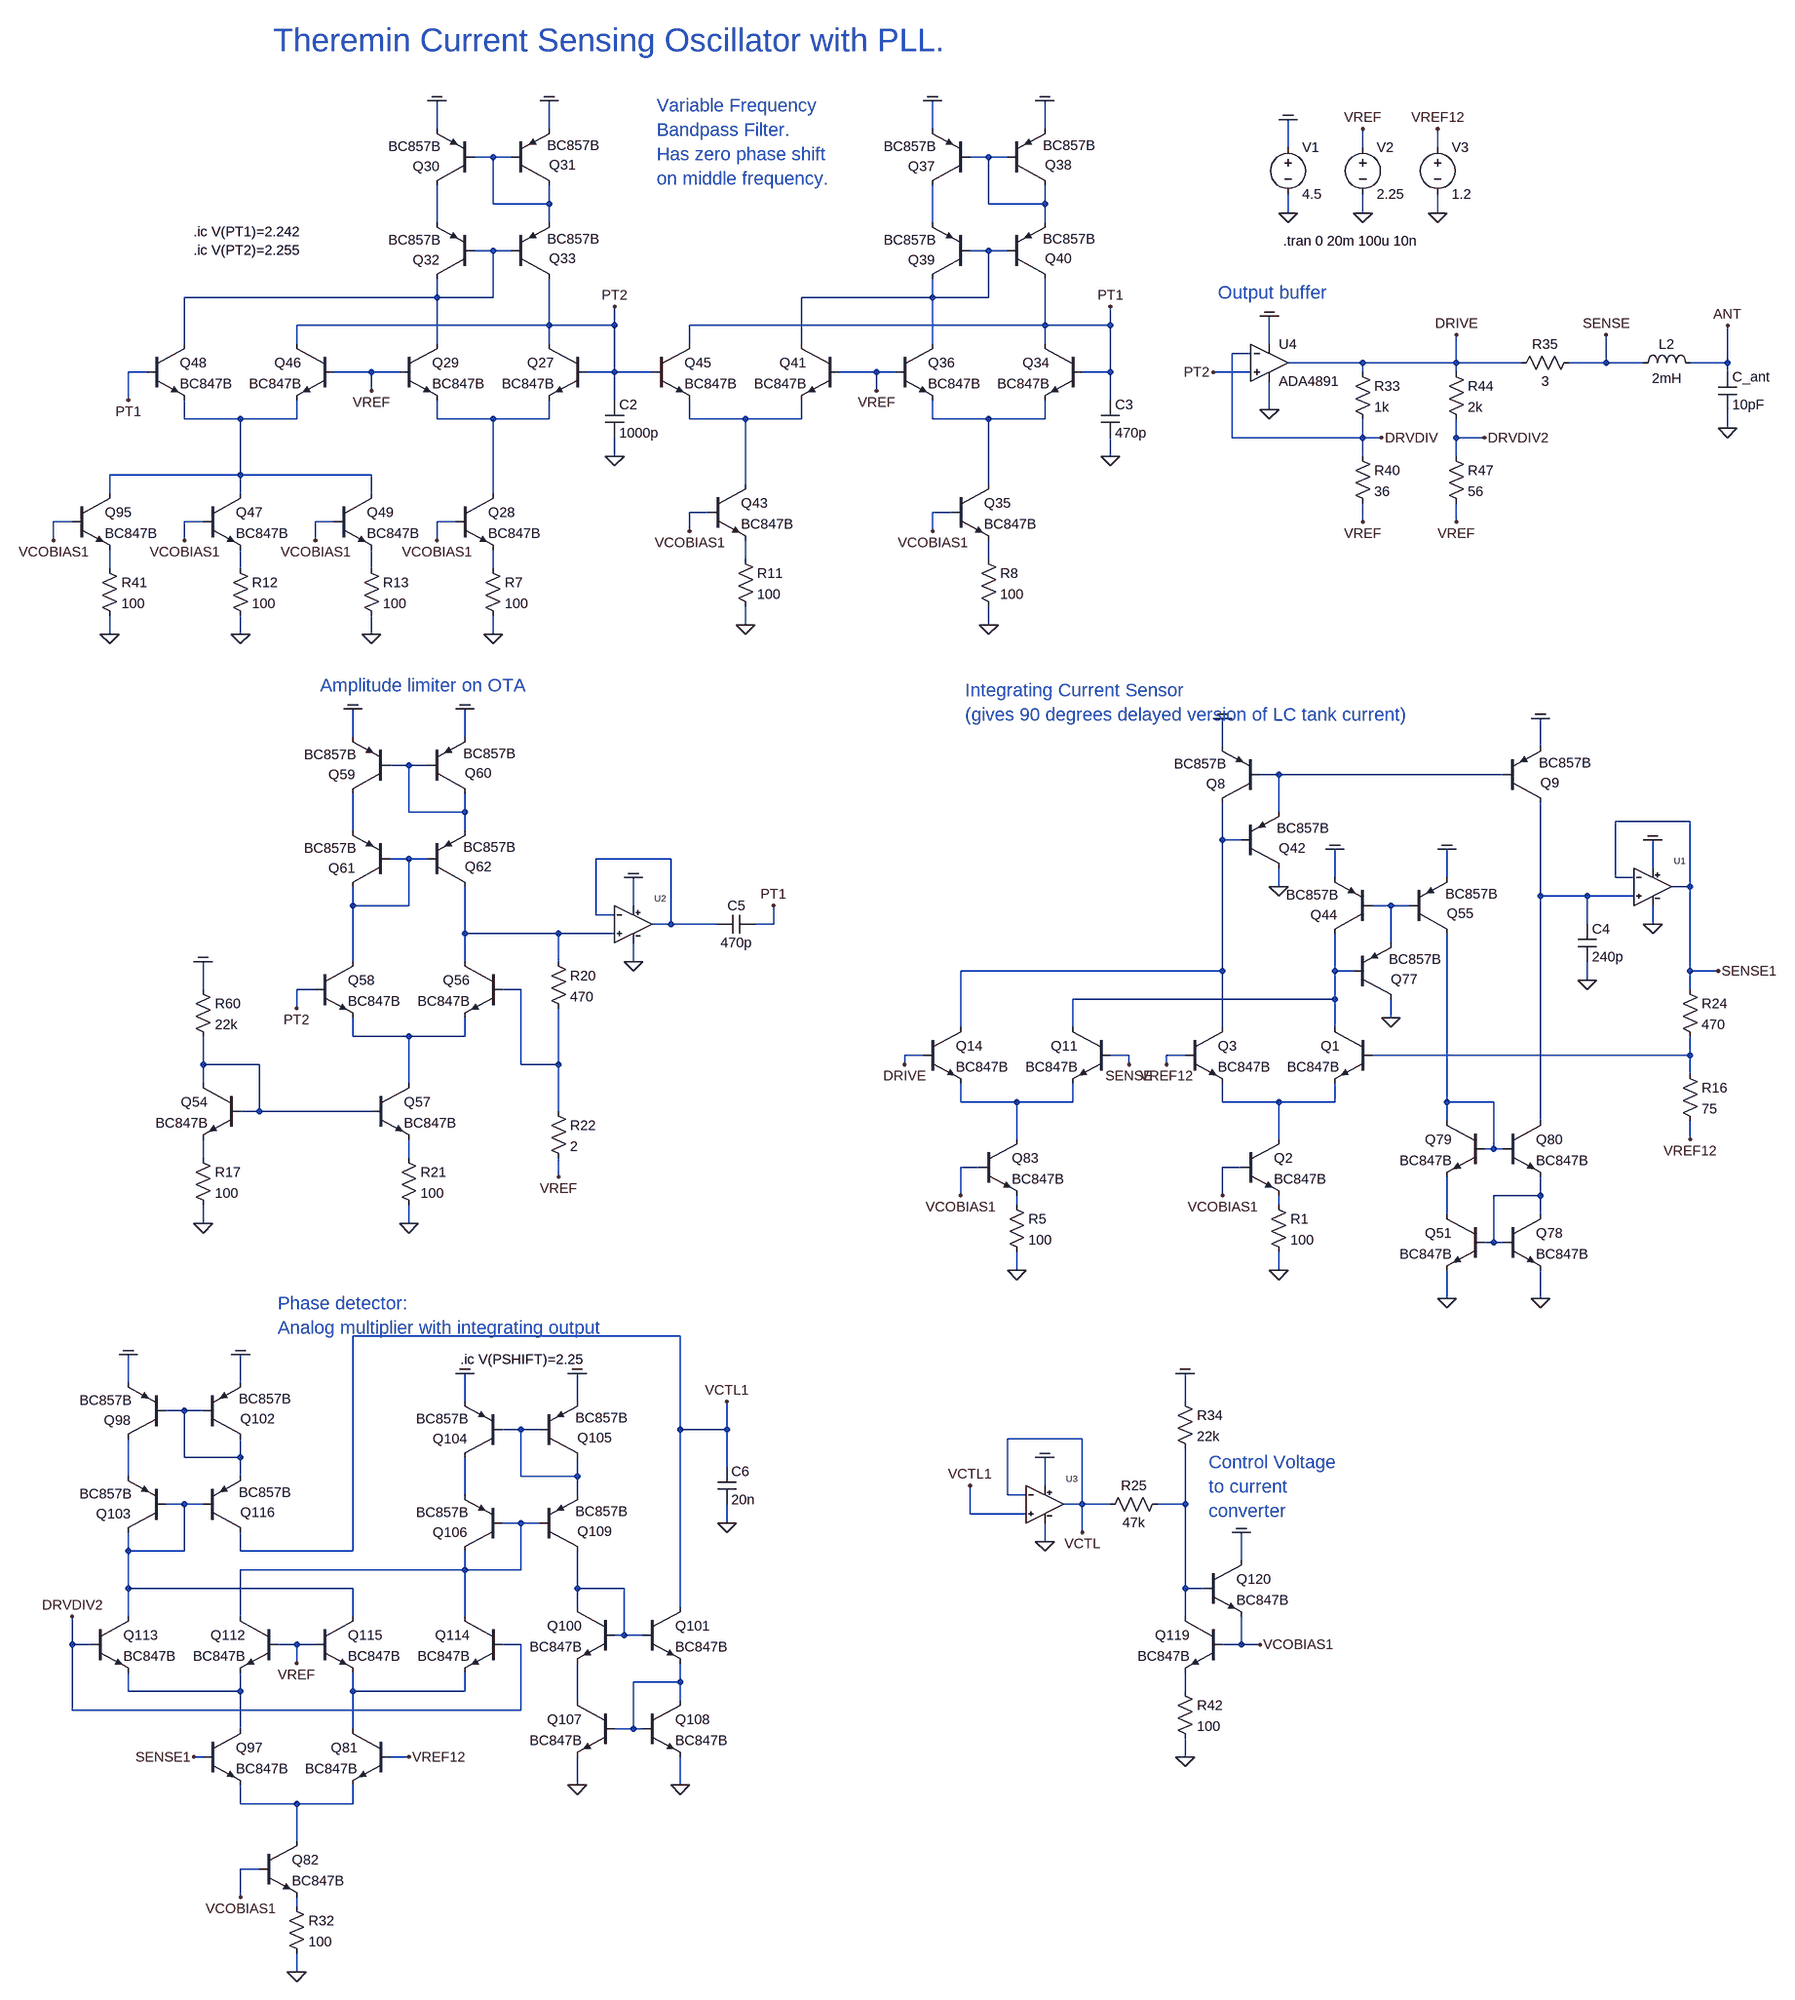
[diagram p0: schematic vco_and_lc_drive_v05.asc]
vco_and_lc_drive_v05.asc, the LTspice schematic file:
Version 4
SHEET 1 13504 21184
WIRE -5552 15856 -5552 15808
WIRE -5360 15856 -5360 15808
WIRE -4704 15856 -4704 15808
WIRE -4512 15856 -4512 15808
WIRE -4096 15888 -4096 15840
WIRE -3968 15888 -3968 15856
WIRE -3840 15888 -3840 15856
WIRE -5456 15904 -5488 15904
WIRE -5424 15904 -5456 15904
WIRE -4608 15904 -4640 15904
WIRE -4576 15904 -4608 15904
WIRE -5456 15984 -5456 15904
WIRE -5360 15984 -5360 15952
WIRE -5360 15984 -5456 15984
WIRE -4608 15984 -4608 15904
WIRE -4512 15984 -4512 15952
WIRE -4512 15984 -4608 15984
WIRE -4096 16000 -4096 15968
WIRE -3968 16000 -3968 15968
WIRE -3840 16000 -3840 15968
WIRE -5552 16016 -5552 15952
WIRE -5360 16016 -5360 15984
WIRE -4704 16016 -4704 15952
WIRE -4512 16016 -4512 15984
WIRE -5456 16064 -5488 16064
WIRE -5424 16064 -5456 16064
WIRE -4608 16064 -4640 16064
WIRE -4576 16064 -4608 16064
WIRE -5552 16144 -5552 16112
WIRE -5552 16144 -5984 16144
WIRE -5456 16144 -5456 16064
WIRE -5456 16144 -5552 16144
WIRE -4704 16144 -4704 16112
WIRE -4704 16144 -4928 16144
WIRE -4608 16144 -4608 16064
WIRE -4608 16144 -4704 16144
WIRE -5360 16192 -5360 16112
WIRE -5360 16192 -5792 16192
WIRE -5248 16192 -5248 16160
WIRE -5248 16192 -5360 16192
WIRE -4512 16192 -4512 16112
WIRE -4512 16192 -5120 16192
WIRE -4400 16192 -4400 16160
WIRE -4400 16192 -4512 16192
WIRE -5984 16224 -5984 16144
WIRE -5792 16224 -5792 16192
WIRE -5552 16224 -5552 16144
WIRE -5360 16224 -5360 16192
WIRE -5120 16224 -5120 16192
WIRE -4928 16224 -4928 16144
WIRE -4704 16224 -4704 16144
WIRE -4512 16224 -4512 16192
WIRE -4128 16224 -4128 16176
WIRE -4160 16240 -4192 16240
WIRE -3968 16256 -4096 16256
WIRE -3808 16256 -3808 16208
WIRE -3808 16256 -3968 16256
WIRE -3696 16256 -3808 16256
WIRE -3552 16256 -3552 16208
WIRE -3552 16256 -3616 16256
WIRE -3488 16256 -3552 16256
WIRE -3344 16256 -3344 16192
WIRE -3344 16256 -3408 16256
WIRE -6048 16272 -6080 16272
WIRE -5664 16272 -5728 16272
WIRE -5616 16272 -5664 16272
WIRE -5248 16272 -5248 16192
WIRE -5248 16272 -5296 16272
WIRE -5184 16272 -5248 16272
WIRE -4800 16272 -4864 16272
WIRE -4768 16272 -4800 16272
WIRE -4400 16272 -4400 16192
WIRE -4400 16272 -4448 16272
WIRE -4160 16272 -4224 16272
WIRE -3968 16272 -3968 16256
WIRE -3808 16272 -3808 16256
WIRE -3344 16272 -3344 16256
WIRE -5664 16304 -5664 16272
WIRE -4800 16304 -4800 16272
WIRE -6080 16320 -6080 16272
WIRE -5248 16320 -5248 16272
WIRE -4400 16320 -4400 16272
WIRE -4128 16336 -4128 16288
WIRE -5984 16352 -5984 16320
WIRE -5888 16352 -5984 16352
WIRE -5792 16352 -5792 16320
WIRE -5792 16352 -5888 16352
WIRE -5552 16352 -5552 16320
WIRE -5456 16352 -5552 16352
WIRE -5360 16352 -5360 16320
WIRE -5360 16352 -5456 16352
WIRE -5120 16352 -5120 16320
WIRE -5024 16352 -5120 16352
WIRE -4928 16352 -4928 16320
WIRE -4928 16352 -5024 16352
WIRE -4704 16352 -4704 16320
WIRE -4608 16352 -4704 16352
WIRE -4512 16352 -4512 16320
WIRE -4512 16352 -4608 16352
WIRE -3344 16368 -3344 16336
WIRE -4192 16384 -4192 16240
WIRE -3968 16384 -3968 16352
WIRE -3968 16384 -4192 16384
WIRE -3936 16384 -3968 16384
WIRE -3808 16384 -3808 16352
WIRE -3760 16384 -3808 16384
WIRE -5248 16416 -5248 16384
WIRE -4400 16416 -4400 16384
WIRE -3968 16416 -3968 16384
WIRE -3808 16416 -3808 16384
WIRE -5888 16448 -5888 16352
WIRE -5888 16448 -6112 16448
WIRE -5664 16448 -5888 16448
WIRE -5024 16464 -5024 16352
WIRE -4608 16464 -4608 16352
WIRE -6112 16480 -6112 16448
WIRE -5888 16480 -5888 16448
WIRE -5664 16480 -5664 16448
WIRE -5456 16480 -5456 16352
WIRE -5088 16512 -5120 16512
WIRE -4672 16512 -4704 16512
WIRE -6176 16528 -6208 16528
WIRE -5952 16528 -5984 16528
WIRE -5728 16528 -5760 16528
WIRE -5520 16528 -5552 16528
WIRE -3968 16528 -3968 16496
WIRE -3808 16528 -3808 16496
WIRE -5120 16544 -5120 16512
WIRE -4704 16544 -4704 16512
WIRE -6208 16560 -6208 16528
WIRE -5984 16560 -5984 16528
WIRE -5760 16560 -5760 16528
WIRE -5552 16560 -5552 16528
WIRE -5024 16592 -5024 16560
WIRE -4608 16592 -4608 16560
WIRE -6112 16608 -6112 16576
WIRE -5888 16608 -5888 16576
WIRE -5664 16608 -5664 16576
WIRE -5456 16608 -5456 16576
WIRE -5024 16704 -5024 16672
WIRE -4608 16704 -4608 16672
WIRE -6112 16720 -6112 16688
WIRE -5888 16720 -5888 16688
WIRE -5664 16720 -5664 16688
WIRE -5456 16720 -5456 16688
WIRE -5696 16896 -5696 16848
WIRE -5504 16896 -5504 16848
WIRE -4208 16912 -4208 16864
WIRE -3664 16912 -3664 16864
WIRE -5600 16944 -5632 16944
WIRE -5568 16944 -5600 16944
WIRE -4112 16960 -4144 16960
WIRE -3728 16960 -4112 16960
WIRE -5600 17024 -5600 16944
WIRE -5504 17024 -5504 16992
WIRE -5504 17024 -5600 17024
WIRE -4112 17024 -4112 16960
WIRE -3408 17040 -3536 17040
WIRE -5696 17056 -5696 16992
WIRE -5504 17056 -5504 17024
WIRE -4208 17072 -4208 17008
WIRE -4176 17072 -4208 17072
WIRE -5600 17104 -5632 17104
WIRE -5568 17104 -5600 17104
WIRE -5152 17104 -5280 17104
WIRE -3472 17120 -3472 17072
WIRE -4016 17136 -4016 17088
WIRE -3824 17136 -3824 17088
WIRE -3536 17136 -3536 17040
WIRE -3504 17136 -3536 17136
WIRE -4112 17152 -4112 17120
WIRE -3408 17152 -3408 17040
WIRE -3408 17152 -3440 17152
WIRE -3664 17168 -3664 17008
WIRE -3584 17168 -3664 17168
WIRE -3504 17168 -3584 17168
WIRE -5696 17184 -5696 17152
WIRE -5600 17184 -5600 17104
WIRE -5600 17184 -5696 17184
WIRE -5216 17184 -5216 17136
WIRE -3920 17184 -3952 17184
WIRE -3888 17184 -3920 17184
WIRE -5280 17200 -5280 17104
WIRE -5248 17200 -5280 17200
WIRE -5152 17216 -5152 17104
WIRE -5152 17216 -5184 17216
WIRE -5072 17216 -5152 17216
WIRE -4976 17216 -4976 17184
WIRE -4976 17216 -5008 17216
WIRE -3584 17216 -3584 17168
WIRE -3472 17216 -3472 17184
WIRE -5504 17232 -5504 17152
WIRE -5344 17232 -5504 17232
WIRE -5248 17232 -5344 17232
WIRE -3920 17248 -3920 17184
WIRE -5696 17280 -5696 17184
WIRE -5504 17280 -5504 17232
WIRE -5344 17280 -5344 17232
WIRE -5216 17280 -5216 17248
WIRE -4208 17296 -4208 17072
WIRE -4208 17296 -4656 17296
WIRE -4016 17296 -4016 17232
WIRE -3984 17296 -4016 17296
WIRE -3408 17296 -3408 17152
WIRE -3360 17296 -3408 17296
WIRE -3584 17312 -3584 17280
WIRE -5952 17328 -5952 17280
WIRE -5760 17328 -5792 17328
WIRE -5408 17328 -5440 17328
WIRE -3408 17328 -3408 17296
WIRE -4016 17344 -4016 17296
WIRE -4016 17344 -4464 17344
WIRE -5792 17360 -5792 17328
WIRE -3920 17376 -3920 17344
WIRE -4656 17392 -4656 17296
WIRE -4464 17392 -4464 17344
WIRE -4208 17392 -4208 17296
WIRE -4016 17392 -4016 17344
WIRE -5696 17408 -5696 17376
WIRE -5600 17408 -5696 17408
WIRE -5504 17408 -5504 17376
WIRE -5504 17408 -5600 17408
WIRE -4720 17440 -4752 17440
WIRE -4368 17440 -4400 17440
WIRE -4272 17440 -4304 17440
WIRE -3408 17440 -3408 17408
WIRE -3408 17440 -3952 17440
WIRE -5952 17456 -5952 17408
WIRE -5856 17456 -5952 17456
WIRE -5408 17456 -5408 17328
WIRE -5344 17456 -5344 17360
WIRE -5344 17456 -5408 17456
WIRE -4752 17456 -4752 17440
WIRE -4368 17456 -4368 17440
WIRE -4304 17456 -4304 17440
WIRE -3408 17472 -3408 17440
WIRE -5952 17488 -5952 17456
WIRE -5600 17488 -5600 17408
WIRE -4656 17520 -4656 17488
WIRE -4560 17520 -4656 17520
WIRE -4464 17520 -4464 17488
WIRE -4464 17520 -4560 17520
WIRE -4208 17520 -4208 17488
WIRE -4112 17520 -4208 17520
WIRE -4016 17520 -4016 17488
WIRE -4016 17520 -4112 17520
WIRE -3824 17520 -3824 17232
WIRE -3744 17520 -3824 17520
WIRE -5856 17536 -5856 17456
WIRE -5856 17536 -5888 17536
WIRE -5664 17536 -5856 17536
WIRE -5344 17536 -5344 17456
WIRE -3824 17552 -3824 17520
WIRE -3664 17552 -3664 17168
WIRE -4560 17584 -4560 17520
WIRE -4112 17584 -4112 17520
WIRE -3408 17584 -3408 17552
WIRE -3744 17600 -3744 17520
WIRE -3744 17600 -3760 17600
WIRE -3728 17600 -3744 17600
WIRE -5952 17616 -5952 17584
WIRE -5600 17616 -5600 17584
WIRE -4624 17632 -4656 17632
WIRE -4176 17632 -4208 17632
WIRE -5344 17648 -5344 17616
WIRE -4656 17680 -4656 17632
WIRE -4208 17680 -4208 17632
WIRE -3664 17680 -3664 17648
WIRE -3664 17680 -3744 17680
WIRE -4560 17696 -4560 17680
WIRE -4112 17696 -4112 17680
WIRE -3824 17712 -3824 17648
WIRE -3664 17712 -3664 17680
WIRE -5952 17728 -5952 17696
WIRE -5600 17728 -5600 17696
WIRE -3744 17760 -3744 17680
WIRE -3744 17760 -3760 17760
WIRE -3728 17760 -3744 17760
WIRE -4560 17808 -4560 17776
WIRE -4112 17808 -4112 17776
WIRE -3824 17856 -3824 17808
WIRE -3664 17856 -3664 17808
WIRE -5136 17920 -5696 17920
WIRE -6080 18000 -6080 17952
WIRE -5888 18000 -5888 17952
WIRE -5504 18032 -5504 17984
WIRE -5312 18032 -5312 17984
WIRE -4272 18032 -4272 17984
WIRE -5984 18048 -6016 18048
WIRE -5952 18048 -5984 18048
WIRE -5408 18080 -5440 18080
WIRE -5376 18080 -5408 18080
WIRE -5136 18080 -5136 17920
WIRE -5056 18080 -5056 18032
WIRE -5056 18080 -5136 18080
WIRE -4448 18096 -4576 18096
WIRE -5984 18128 -5984 18048
WIRE -5888 18128 -5888 18096
WIRE -5888 18128 -5984 18128
WIRE -5056 18144 -5056 18080
WIRE -6080 18160 -6080 18096
WIRE -5888 18160 -5888 18128
WIRE -5408 18160 -5408 18080
WIRE -5312 18160 -5312 18128
WIRE -5312 18160 -5408 18160
WIRE -4512 18176 -4512 18128
WIRE -5504 18192 -5504 18128
WIRE -5312 18192 -5312 18160
WIRE -4576 18192 -4576 18096
WIRE -4544 18192 -4576 18192
WIRE -5984 18208 -6016 18208
WIRE -5952 18208 -5984 18208
WIRE -4448 18208 -4448 18096
WIRE -4448 18208 -4480 18208
WIRE -4400 18208 -4448 18208
WIRE -4272 18208 -4272 18112
WIRE -4272 18208 -4320 18208
WIRE -4640 18224 -4640 18176
WIRE -4544 18224 -4640 18224
WIRE -5408 18240 -5440 18240
WIRE -5376 18240 -5408 18240
WIRE -5056 18240 -5056 18208
WIRE -4448 18256 -4448 18208
WIRE -4512 18272 -4512 18240
WIRE -6080 18288 -6080 18256
WIRE -5984 18288 -5984 18208
WIRE -5984 18288 -6080 18288
WIRE -5888 18288 -5888 18256
WIRE -5696 18288 -5696 17920
WIRE -5696 18288 -5888 18288
WIRE -4176 18304 -4176 18256
WIRE -5504 18320 -5504 18288
WIRE -5504 18320 -5888 18320
WIRE -5408 18320 -5408 18240
WIRE -5408 18320 -5504 18320
WIRE -6080 18352 -6080 18288
WIRE -5696 18352 -6080 18352
WIRE -5312 18352 -5312 18288
WIRE -5232 18352 -5312 18352
WIRE -4272 18352 -4272 18208
WIRE -4240 18352 -4272 18352
WIRE -5312 18384 -5312 18352
WIRE -5136 18384 -5136 18080
WIRE -6080 18400 -6080 18352
WIRE -5888 18400 -5888 18320
WIRE -5696 18400 -5696 18352
WIRE -5504 18400 -5504 18320
WIRE -4272 18400 -4272 18352
WIRE -5232 18432 -5232 18352
WIRE -5232 18432 -5248 18432
WIRE -5200 18432 -5232 18432
WIRE -6176 18448 -6176 18400
WIRE -6144 18448 -6176 18448
WIRE -5792 18448 -5824 18448
WIRE -5760 18448 -5792 18448
WIRE -5408 18448 -5440 18448
WIRE -4176 18448 -4176 18400
WIRE -4176 18448 -4208 18448
WIRE -4144 18448 -4176 18448
WIRE -5792 18480 -5792 18448
WIRE -5136 18512 -5136 18480
WIRE -5136 18512 -5216 18512
WIRE -6080 18528 -6080 18496
WIRE -5888 18528 -5888 18496
WIRE -5888 18528 -6080 18528
WIRE -5696 18528 -5696 18496
WIRE -5504 18528 -5504 18496
WIRE -5504 18528 -5696 18528
WIRE -4272 18528 -4272 18496
WIRE -5312 18544 -5312 18480
WIRE -5136 18544 -5136 18512
WIRE -6176 18560 -6176 18448
WIRE -5408 18560 -5408 18448
WIRE -5408 18560 -6176 18560
WIRE -5888 18592 -5888 18528
WIRE -5696 18592 -5696 18528
WIRE -5216 18592 -5216 18512
WIRE -5216 18592 -5248 18592
WIRE -5200 18592 -5216 18592
WIRE -5952 18640 -5968 18640
WIRE -5600 18640 -5632 18640
WIRE -4272 18640 -4272 18608
WIRE -5312 18688 -5312 18640
WIRE -5136 18688 -5136 18640
WIRE -5888 18720 -5888 18688
WIRE -5792 18720 -5888 18720
WIRE -5696 18720 -5696 18688
WIRE -5696 18720 -5792 18720
WIRE -5792 18784 -5792 18720
WIRE -5856 18832 -5888 18832
WIRE -5888 18880 -5888 18832
WIRE -5792 18896 -5792 18880
WIRE -5792 19008 -5792 18976
FLAG -4096 16000 0
FLAG -4096 15840 COM
FLAG -3968 16000 0
FLAG -3968 15856 VREF
FLAG -5952 17280 COM
FLAG -5952 17728 0
FLAG -5552 16560 VCOBIAS1
FLAG -5456 16720 0
FLAG -5552 15808 COM
FLAG -5360 15808 COM
FLAG -4704 16544 VCOBIAS1
FLAG -4400 16416 0
FLAG -4704 15808 COM
FLAG -4512 15808 COM
FLAG -5120 16544 VCOBIAS1
FLAG -5024 16704 0
FLAG -4800 16304 VREF
FLAG -5984 16560 VCOBIAS1
FLAG -5888 16720 0
FLAG -5664 16304 VREF
FLAG -5344 17648 VREF
FLAG -5600 17728 0
FLAG -5696 16848 COM
FLAG -5504 16848 COM
FLAG -5216 17280 0
FLAG -5216 17136 COM
FLAG -5248 16160 PT2
FLAG -3968 16528 VREF
FLAG -3344 16368 0
FLAG -3344 16192 ANT
FLAG -3552 16208 SENSE
FLAG -3808 16208 DRIVE
FLAG -3936 16384 DRVDIV
FLAG -3840 16000 0
FLAG -3840 15856 VREF12
FLAG -4112 17808 0
FLAG -4304 17456 VREF12
FLAG -4208 16864 COM
FLAG -3664 16864 COM
FLAG -4208 17680 VCOBIAS1
FLAG -4752 17456 DRIVE
FLAG -4112 17152 0
FLAG -4016 17088 COM
FLAG -3824 17088 COM
FLAG -3920 17376 0
FLAG -4560 17808 0
FLAG -4656 17680 VCOBIAS1
FLAG -4368 17456 SENSE
FLAG -3360 17296 SENSE1
FLAG -3408 17584 VREF12
FLAG -3760 16384 DRVDIV2
FLAG -4400 16160 PT1
FLAG -4976 17184 PT1
FLAG -6080 16320 PT1
FLAG -5792 17360 PT2
FLAG -5760 16560 VCOBIAS1
FLAG -5664 16720 0
FLAG -6208 16560 VCOBIAS1
FLAG -6112 16720 0
FLAG -3808 16528 VREF
FLAG -3584 17312 0
FLAG -5792 19008 0
FLAG -5888 18880 VCOBIAS1
FLAG -5312 18688 0
FLAG -5136 18688 0
FLAG -5056 18032 VCTL1
FLAG -5056 18240 0
FLAG -5600 18640 VREF12
FLAG -5968 18640 SENSE1
FLAG -5792 18480 VREF
FLAG -6176 18400 DRVDIV2
FLAG -5504 17984 COM
FLAG -5312 17984 COM
FLAG -6080 17952 COM
FLAG -5888 17952 COM
FLAG -4512 18272 0
FLAG -4512 18128 COM
FLAG -3824 17856 0
FLAG -3664 17856 0
FLAG -4272 17984 COM
FLAG -4144 18448 VCOBIAS1
FLAG -4176 18256 COM
FLAG -4272 18640 0
FLAG -5248 16416 0
FLAG -4608 16704 0
FLAG -4448 18256 VCTL
FLAG -4640 18176 VCTL1
FLAG -3472 17216 0
FLAG -3472 17072 COM
FLAG -4128 16176 COM
FLAG -4128 16336 0
FLAG -4224 16272 PT2
SYMBOL voltage -4096 15872 R0
SYMATTR InstName V1
SYMATTR Value 4.5
SYMBOL Voltage -3968 15872 R0
SYMATTR InstName V2
SYMATTR Value 2.25
SYMBOL Res -5968 17312 R0
SYMATTR InstName R60
SYMATTR Value 22k
SYMBOL npn -5888 17488 M0
SYMATTR InstName Q54
SYMATTR Value BC847B
SYMBOL Res -5968 17600 R0
SYMATTR InstName R17
SYMATTR Value 100
SYMBOL npn -5296 16224 M0
SYMATTR InstName Q27
SYMATTR Value BC847B
SYMBOL npn -5520 16480 R0
SYMATTR InstName Q28
SYMATTR Value BC847B
SYMBOL npn -5616 16224 R0
SYMATTR InstName Q29
SYMATTR Value BC847B
SYMBOL Res -5472 16592 R0
SYMATTR InstName R7
SYMATTR Value 100
SYMBOL pnp -5488 15952 R180
WINDOW 0 60 32 Left 2
WINDOW 3 58 66 Left 2
SYMATTR InstName Q30
SYMATTR Value BC857B
SYMBOL pnp -5424 15952 M180
WINDOW 0 64 34 Left 2
WINDOW 3 61 68 Left 2
SYMATTR InstName Q31
SYMATTR Value BC857B
SYMBOL pnp -5488 16112 R180
WINDOW 0 60 32 Left 2
WINDOW 3 58 66 Left 2
SYMATTR InstName Q32
SYMATTR Value BC857B
SYMBOL pnp -5424 16112 M180
WINDOW 0 64 34 Left 2
WINDOW 3 61 68 Left 2
SYMATTR InstName Q33
SYMATTR Value BC857B
SYMBOL npn -4448 16224 M0
SYMATTR InstName Q34
SYMATTR Value BC847B
SYMBOL npn -4672 16464 R0
SYMATTR InstName Q35
SYMATTR Value BC847B
SYMBOL npn -4768 16224 R0
SYMATTR InstName Q36
SYMATTR Value BC847B
SYMBOL Res -4624 16576 R0
SYMATTR InstName R8
SYMATTR Value 100
SYMBOL pnp -4640 15952 R180
WINDOW 0 60 32 Left 2
WINDOW 3 58 66 Left 2
SYMATTR InstName Q37
SYMATTR Value BC857B
SYMBOL pnp -4576 15952 M180
WINDOW 0 64 34 Left 2
WINDOW 3 61 68 Left 2
SYMATTR InstName Q38
SYMATTR Value BC857B
SYMBOL pnp -4640 16112 R180
WINDOW 0 60 32 Left 2
WINDOW 3 58 66 Left 2
SYMATTR InstName Q39
SYMATTR Value BC857B
SYMBOL pnp -4576 16112 M180
WINDOW 0 64 34 Left 2
WINDOW 3 61 68 Left 2
SYMATTR InstName Q40
SYMATTR Value BC857B
SYMBOL Cap -5264 16320 R0
SYMATTR InstName C2
SYMATTR Value 1000p
SYMBOL Cap -5008 17200 R90
WINDOW 0 0 32 VBottom 2
WINDOW 3 32 32 VTop 2
SYMATTR InstName C5
SYMATTR Value 470p
SYMBOL npn -4864 16224 M0
SYMATTR InstName Q41
SYMATTR Value BC847B
SYMBOL npn -5088 16464 R0
SYMATTR InstName Q43
SYMATTR Value BC847B
SYMBOL npn -5184 16224 R0
SYMATTR InstName Q45
SYMATTR Value BC847B
SYMBOL Res -5040 16576 R0
SYMATTR InstName R11
SYMATTR Value 100
SYMBOL npn -5728 16224 M0
SYMATTR InstName Q46
SYMATTR Value BC847B
SYMBOL npn -5952 16480 R0
SYMATTR InstName Q47
SYMATTR Value BC847B
SYMBOL npn -6048 16224 R0
SYMATTR InstName Q48
SYMATTR Value BC847B
SYMBOL Res -5904 16592 R0
SYMATTR InstName R12
SYMATTR Value 100
SYMBOL npn -5440 17280 M0
SYMATTR InstName Q56
SYMATTR Value BC847B
SYMBOL npn -5664 17488 R0
SYMATTR InstName Q57
SYMATTR Value BC847B
SYMBOL npn -5760 17280 R0
SYMATTR InstName Q58
SYMATTR Value BC847B
SYMBOL Res -5360 17264 R0
SYMATTR InstName R20
SYMATTR Value 470
SYMBOL Res -5616 17600 R0
SYMATTR InstName R21
SYMATTR Value 100
SYMBOL Res -5360 17520 R0
SYMATTR InstName R22
SYMATTR Value 2
SYMBOL pnp -5632 16992 R180
WINDOW 0 60 32 Left 2
WINDOW 3 58 66 Left 2
SYMATTR InstName Q59
SYMATTR Value BC857B
SYMBOL pnp -5568 16992 M180
WINDOW 0 64 34 Left 2
WINDOW 3 61 68 Left 2
SYMATTR InstName Q60
SYMATTR Value BC857B
SYMBOL pnp -5632 17152 R180
WINDOW 0 60 32 Left 2
WINDOW 3 58 66 Left 2
SYMATTR InstName Q61
SYMATTR Value BC857B
SYMBOL pnp -5568 17152 M180
WINDOW 0 64 34 Left 2
WINDOW 3 61 68 Left 2
SYMATTR InstName Q62
SYMATTR Value BC857B
SYMBOL MCP6021 -5216 17216 R0
SYMATTR InstName U2
SYMBOL Res -3984 16256 R0
SYMATTR InstName R33
SYMATTR Value 1k
SYMBOL ind -3504 16272 R270
WINDOW 0 32 56 VTop 2
WINDOW 3 5 56 VBottom 2
SYMATTR InstName L2
SYMATTR Value 2mH
SYMATTR SpiceLine Rser=120 Cpar=1pF
SYMBOL Cap -3360 16272 R0
SYMATTR InstName C_ant
SYMATTR Value 10pF
SYMBOL Res -3712 16272 R270
WINDOW 0 32 56 VTop 2
WINDOW 3 0 56 VBottom 2
SYMATTR InstName R35
SYMATTR Value 3
SYMBOL Voltage -3840 15872 R0
SYMATTR InstName V3
SYMATTR Value 1.2
SYMBOL npn -3952 17392 M0
SYMATTR InstName Q1
SYMATTR Value BC847B
SYMBOL npn -4176 17584 R0
SYMATTR InstName Q2
SYMATTR Value BC847B
SYMBOL Res -4128 17680 R0
SYMATTR InstName R1
SYMATTR Value 100
SYMBOL npn -4272 17392 R0
SYMATTR InstName Q3
SYMATTR Value BC847B
SYMBOL pnp -4144 17008 R180
WINDOW 0 60 32 Left 2
WINDOW 3 58 66 Left 2
SYMATTR InstName Q8
SYMATTR Value BC857B
SYMBOL pnp -3728 17008 M180
WINDOW 0 64 34 Left 2
WINDOW 3 61 68 Left 2
SYMATTR InstName Q9
SYMATTR Value BC857B
SYMBOL npn -4400 17392 M0
SYMATTR InstName Q11
SYMATTR Value BC847B
SYMBOL npn -4720 17392 R0
SYMATTR InstName Q14
SYMATTR Value BC847B
SYMBOL pnp -4176 17120 M180
WINDOW 0 64 34 Left 2
WINDOW 3 61 68 Left 2
SYMATTR InstName Q42
SYMATTR Value BC857B
SYMBOL pnp -3952 17232 R180
WINDOW 0 60 32 Left 2
WINDOW 3 58 66 Left 2
SYMATTR InstName Q44
SYMATTR Value BC857B
SYMBOL pnp -3888 17232 M180
WINDOW 0 64 34 Left 2
WINDOW 3 61 68 Left 2
SYMATTR InstName Q55
SYMATTR Value BC857B
SYMBOL pnp -3984 17344 M180
WINDOW 0 64 34 Left 2
WINDOW 3 61 68 Left 2
SYMATTR InstName Q77
SYMATTR Value BC857B
SYMBOL npn -4624 17584 R0
SYMATTR InstName Q83
SYMATTR Value BC847B
SYMBOL Res -4576 17680 R0
SYMATTR InstName R5
SYMATTR Value 100
SYMBOL Res -3424 17456 R0
SYMATTR InstName R16
SYMATTR Value 75
SYMBOL Res -3424 17312 R0
SYMATTR InstName R24
SYMATTR Value 470
SYMBOL Res -3984 16400 R0
SYMATTR InstName R40
SYMATTR Value 36
SYMBOL Cap -4416 16320 R0
SYMATTR InstName C3
SYMATTR Value 470p
SYMBOL npn -5728 16480 R0
SYMATTR InstName Q49
SYMATTR Value BC847B
SYMBOL Res -5680 16592 R0
SYMATTR InstName R13
SYMATTR Value 100
SYMBOL npn -6176 16480 R0
SYMATTR InstName Q95
SYMATTR Value BC847B
SYMBOL Res -6128 16592 R0
SYMATTR InstName R41
SYMATTR Value 100
SYMBOL Res -3824 16256 R0
SYMATTR InstName R44
SYMATTR Value 2k
SYMBOL Res -3824 16400 R0
SYMATTR InstName R47
SYMATTR Value 56
SYMBOL Cap -3600 17216 R0
SYMATTR InstName C4
SYMATTR Value 240p
SYMBOL npn -5632 18592 M0
SYMATTR InstName Q81
SYMATTR Value BC847B
SYMBOL npn -5856 18784 R0
SYMATTR InstName Q82
SYMATTR Value BC847B
SYMBOL Res -5808 18880 R0
SYMATTR InstName R32
SYMATTR Value 100
SYMBOL npn -5952 18592 R0
SYMATTR InstName Q97
SYMATTR Value BC847B
SYMBOL npn -5248 18544 M0
SYMATTR InstName Q107
SYMATTR Value BC847B
SYMBOL npn -5200 18544 R0
SYMATTR InstName Q108
SYMATTR Value BC847B
SYMBOL Cap -5072 18144 R0
SYMATTR InstName C6
SYMATTR Value 20n
SYMBOL npn -5824 18400 M0
SYMATTR InstName Q112
SYMATTR Value BC847B
SYMBOL npn -6144 18400 R0
SYMATTR InstName Q113
SYMATTR Value BC847B
SYMBOL npn -5440 18400 M0
SYMATTR InstName Q114
SYMATTR Value BC847B
SYMBOL npn -5760 18400 R0
SYMATTR InstName Q115
SYMATTR Value BC847B
SYMBOL npn -5248 18384 M0
SYMATTR InstName Q100
SYMATTR Value BC847B
SYMBOL npn -5200 18384 R0
SYMATTR InstName Q101
SYMATTR Value BC847B
SYMBOL pnp -5440 18128 R180
WINDOW 0 60 32 Left 2
WINDOW 3 58 66 Left 2
SYMATTR InstName Q104
SYMATTR Value BC857B
SYMBOL pnp -5376 18128 M180
WINDOW 0 64 34 Left 2
WINDOW 3 61 68 Left 2
SYMATTR InstName Q105
SYMATTR Value BC857B
SYMBOL pnp -5440 18288 R180
WINDOW 0 60 32 Left 2
WINDOW 3 58 66 Left 2
SYMATTR InstName Q106
SYMATTR Value BC857B
SYMBOL pnp -5376 18288 M180
WINDOW 0 64 34 Left 2
WINDOW 3 61 68 Left 2
SYMATTR InstName Q109
SYMATTR Value BC857B
SYMBOL pnp -6016 18096 R180
WINDOW 0 60 32 Left 2
WINDOW 3 58 66 Left 2
SYMATTR InstName Q98
SYMATTR Value BC857B
SYMBOL pnp -5952 18096 M180
WINDOW 0 64 34 Left 2
WINDOW 3 61 68 Left 2
SYMATTR InstName Q102
SYMATTR Value BC857B
SYMBOL pnp -6016 18256 R180
WINDOW 0 60 32 Left 2
WINDOW 3 58 66 Left 2
SYMATTR InstName Q103
SYMATTR Value BC857B
SYMBOL pnp -5952 18256 M180
WINDOW 0 64 34 Left 2
WINDOW 3 61 68 Left 2
SYMATTR InstName Q116
SYMATTR Value BC857B
SYMBOL MCP6021 -4512 18208 R0
SYMATTR InstName U3
SYMBOL npn -3760 17712 M0
SYMATTR InstName Q51
SYMATTR Value BC847B
SYMBOL npn -3728 17712 R0
SYMATTR InstName Q78
SYMATTR Value BC847B
SYMBOL npn -3760 17552 M0
SYMATTR InstName Q79
SYMATTR Value BC847B
SYMBOL npn -3728 17552 R0
SYMATTR InstName Q80
SYMATTR Value BC847B
SYMBOL Res -4304 18192 R90
WINDOW 0 0 56 VBottom 2
WINDOW 3 32 56 VTop 2
SYMATTR InstName R25
SYMATTR Value 47k
SYMBOL Res -4288 18016 R0
SYMATTR InstName R34
SYMATTR Value 22k
SYMBOL npn -4208 18400 M0
SYMATTR InstName Q119
SYMATTR Value BC847B
SYMBOL npn -4240 18304 R0
SYMATTR InstName Q120
SYMATTR Value BC847B
SYMBOL Res -4288 18512 R0
SYMATTR InstName R42
SYMATTR Value 100
SYMBOL MCP6021 -3472 17152 R0
SYMATTR InstName U1
SYMBOL OpAmps/ADA4891 -4128 16192 R0
SYMATTR InstName U4
TEXT -4104 16048 Left 2 !.tran 0 20m 100u 10n
TEXT -5832 15704 Left 5 ;Theremin Current Sensing Oscillator with PLL.
TEXT -5968 16032 Left 2 !.ic V(PT1)=2.242\n.ic V(PT2)=2.255
TEXT -4216 16136 Left 3 ;Output buffer
TEXT -5752 16808 Left 3 ;Amplitude limiter on OTA
TEXT -5176 15816 Left 3 ;Variable Frequency \nBandpass Filter.\nHas zero phase shift \non middle frequency.
TEXT -4648 16816 Left 3 ;Integrating Current Sensor\n(gives 90 degrees delayed version of LC tank current)
TEXT -5512 17960 Left 2 !.ic V(PSHIFT)=2.25
TEXT -5824 17864 Left 3 ;Phase detector:\nAnalog multiplier with integrating output
TEXT -4232 18136 Left 3 ;Control Voltage \nto current\nconverter

The netlist it stands for:
* vco_and_lc_drive_v05.asc
V1 COM 0 4.5
V2 VREF 0 2.25
R60 COM N030 22k
Q54 N030 N030 N034 0 BC847B
R17 N034 0 100
Q27 PT2 PT2 N008 0 BC847B
Q28 N008 VCOBIAS1 N016 0 BC847B
Q29 N005 VREF N008 0 BC847B
R7 N016 0 100
Q30 N003 N001 COM 0 BC857B
Q31 N001 N001 COM 0 BC857B
Q32 N005 N005 N003 0 BC857B
Q33 PT2 N005 N001 0 BC857B
Q34 PT1 PT1 N010 0 BC847B
Q35 N010 VCOBIAS1 N012 0 BC847B
Q36 N006 VREF N010 0 BC847B
R8 N012 0 100
Q37 N004 N002 COM 0 BC857B
Q38 N002 N002 COM 0 BC857B
Q39 N006 N006 N004 0 BC857B
Q40 PT1 N006 N002 0 BC857B
C2 PT2 0 1000p
C5 PT1 N022 470p
Q41 N006 VREF N009 0 BC847B
Q43 N009 VCOBIAS1 N011 0 BC847B
Q45 PT1 PT2 N009 0 BC847B
R11 N011 0 100
Q46 PT2 VREF N007 0 BC847B
Q47 N007 VCOBIAS1 N014 0 BC847B
Q48 N005 PT1 N007 0 BC847B
R12 N014 0 100
Q56 N025 N027 N028 0 BC847B
Q57 N028 N030 N035 0 BC847B
Q58 N021 PT2 N028 0 BC847B
R20 N025 N027 470
R21 N035 0 100
R22 N027 VREF 2
Q59 N019 N017 COM 0 BC857B
Q60 N017 N017 COM 0 BC857B
Q61 N021 N021 N019 0 BC857B
Q62 N025 N021 N017 0 BC857B
XU2 N025 N022 COM 0 N022 MCP6021  ; pins In+ In- V+ V- OUT
R33 DRIVE DRVDIV 1k
L2 SENSE ANT 2mH Rser=120 Cpar=1pF
C_ant ANT 0 10pF
R35 DRIVE SENSE 3
V3 VREF12 0 1.2
Q1 N026 N029 N032 0 BC847B
Q2 N032 VCOBIAS1 N038 0 BC847B
R1 N038 0 100
Q3 N020 VREF12 N032 0 BC847B
Q8 N020 N018 COM 0 BC857B
Q9 N023 N018 COM 0 BC857B
Q11 N026 SENSE N031 0 BC847B
Q14 N020 DRIVE N031 0 BC847B
Q42 0 N020 N018 0 BC857B
Q44 N026 N024 COM 0 BC857B
Q55 N033 N024 COM 0 BC857B
Q77 0 N026 N024 0 BC857B
Q83 N031 VCOBIAS1 N037 0 BC847B
R5 N037 0 100
R16 N029 VREF12 75
R24 SENSE1 N029 470
R40 DRVDIV VREF 36
C3 PT1 0 470p
Q49 N007 VCOBIAS1 N015 0 BC847B
R13 N015 0 100
Q95 N007 VCOBIAS1 N013 0 BC847B
R41 N013 0 100
R44 DRIVE DRVDIV2 2k
R47 DRVDIV2 VREF 56
C4 N023 0 240p
Q81 N050 VREF12 N053 0 BC847B
Q82 N053 VCOBIAS1 N054 0 BC847B
R32 N054 0 100
Q97 N049 SENSE1 N053 0 BC847B
Q107 N052 N048 0 0 BC847B
Q108 N048 N048 0 0 BC847B
C6 VCTL1 0 20n
Q112 N046 VREF N049 0 BC847B
Q113 N044 DRVDIV2 N049 0 BC847B
Q114 N046 DRVDIV2 N050 0 BC847B
Q115 N044 VREF N050 0 BC847B
Q100 N047 N047 N052 0 BC847B
Q101 VCTL1 N047 N048 0 BC847B
Q104 N043 N041 COM 0 BC857B
Q105 N041 N041 COM 0 BC857B
Q106 N046 N046 N043 0 BC857B
Q109 N047 N046 N041 0 BC857B
Q98 N042 N040 COM 0 BC857B
Q102 N040 N040 COM 0 BC857B
Q103 N044 N044 N042 0 BC857B
Q116 VCTL1 N044 N040 0 BC857B
XU3 VCTL1 VCTL COM 0 VCTL MCP6021  ; pins In+ In- V+ V- OUT
Q51 N039 N036 0 0 BC847B
Q78 N036 N036 0 0 BC847B
Q79 N033 N033 N039 0 BC847B
Q80 N023 N033 N036 0 BC847B
R25 N045 VCTL 47k
R34 COM N045 22k
Q119 N045 VCOBIAS1 N051 0 BC847B
Q120 COM N045 VCOBIAS1 0 BC847B
R42 N051 0 100
XU1 N023 SENSE1 COM 0 SENSE1 MCP6021  ; pins In+ In- V+ V- OUT
XU4 PT2 DRVDIV COM 0 DRIVE ADA4891-1  ; pins In+ In- V+ V- OUT
.model NPN NPN
.model PNP PNP
.lib standard.bjt
.tran 0 20m 100u 10n
* Theremin Current Sensing Oscillator with PLL.
.ic V(PT1)=2.242
.ic V(PT2)=2.255
* Output buffer
* Amplitude limiter on OTA
* Variable Frequency
* Bandpass Filter.
* Has zero phase shift
* on middle frequency.
* Integrating Current Sensor
* (gives 90 degrees delayed version of LC tank current)
.ic V(PSHIFT)=2.25
* Phase detector:
* Analog multiplier with integrating output
* Control Voltage
* to current
* converter
.lib MCP6021.cir
.lib ADA4891-1.lib
.backanno
.end